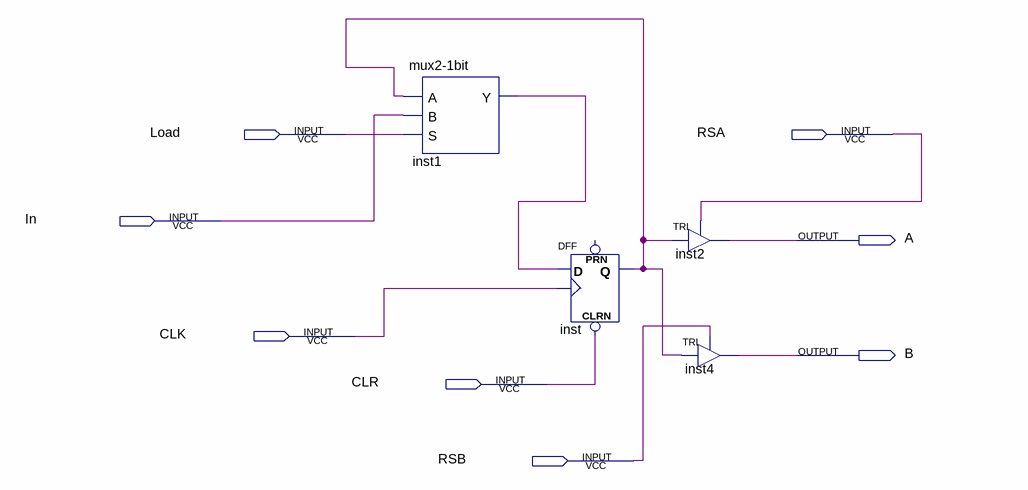
[diagram p0: schematic sheet]
// Quartus schematic RFC.bdf as structural Verilog: 4 symbols, 8 pins
module RFC (
  input  Load,
  input  RSA,
  input  In,
  input  CLK,
  input  CLR,
  input  RSB,
  output A,
  output B
);

  wire inst1_y, inst_q;

  \mux2-1bit  inst1 (.A(inst_q), .B(In), .S(Load), .Y(inst1_y));
  DFF inst (.CLRN(CLR), .CLK(CLK), .D(inst1_y), .Q(inst_q));  // open: PRN
  TRI inst2 (.IN(inst_q), .OE(RSA), .OUT(A));
  TRI inst4 (.IN(inst_q), .OE(RSB), .OUT(B));
endmodule
